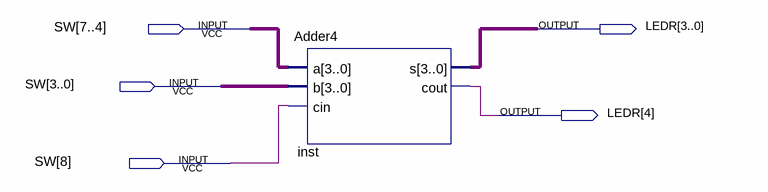
[diagram p0: schematic sheet]
// Quartus schematic Adder4.bdf as structural Verilog: 1 symbols, 5 pins
module Adder4 (
  input  [8:0] SW,
  output [4:0] LEDR
);

  Adder4 inst (.a(SW[7:4]), .b(SW[3:0]), .cin(SW[8]), .s(LEDR[3:0]), .cout(LEDR[4]));
endmodule
